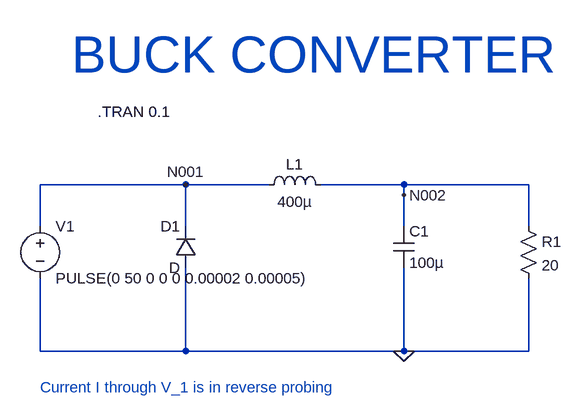
[diagram p0: schematic BuckConverter.asc]
BuckConverter.asc, the LTspice schematic file:
Version 4
SHEET 1 1764 980
WIRE 1184 368 960 368
WIRE 1312 368 1184 368
WIRE 1520 368 1392 368
WIRE 1712 368 1520 368
WIRE 1520 384 1520 368
WIRE 960 432 960 368
WIRE 1184 432 1184 368
WIRE 1520 432 1520 384
WIRE 1712 432 1712 368
WIRE 960 624 960 512
WIRE 1184 624 1184 496
WIRE 1184 624 960 624
WIRE 1520 624 1520 496
WIRE 1520 624 1184 624
WIRE 1712 624 1712 512
WIRE 1712 624 1520 624
FLAG 1520 624 0
FLAG 1184 368 N001
FLAG 1520 384 N002
SYMBOL voltage 960 416 R0
SYMATTR InstName V1
SYMATTR Value PULSE(0 50 0 0 0 0.00002 0.00005)
SYMBOL diode 1200 496 R180
WINDOW 0 24 64 Left 2
WINDOW 3 24 0 Left 2
SYMATTR InstName D1
SYMBOL ind 1296 384 R270
WINDOW 0 32 56 VTop 2
WINDOW 3 5 56 VBottom 2
SYMATTR InstName L1
SYMATTR Value 400µ
SYMBOL cap 1504 432 R0
SYMATTR InstName C1
SYMATTR Value 100µ
SYMBOL res 1696 416 R0
SYMATTR InstName R1
SYMATTR Value 20
TEXT 1048 256 Left 2 !.TRAN 0.1
TEXT 960 680 Left 2 ;Current I through V_1 is in reverse probing
TEXT 1008 168 Left 6 ;BUCK CONVERTER

The netlist it stands for:
* BuckConverter.asc
V1 N001 0 PULSE(0 50 0 0 0 0.00002 0.00005)
D1 0 N001 D
L1 N001 N002 400µ
C1 N002 0 100µ
R1 N002 0 20
.model D D
.lib standard.dio
.TRAN 0.1
* Current I through V_1 is in reverse probing
* BUCK CONVERTER
.backanno
.end